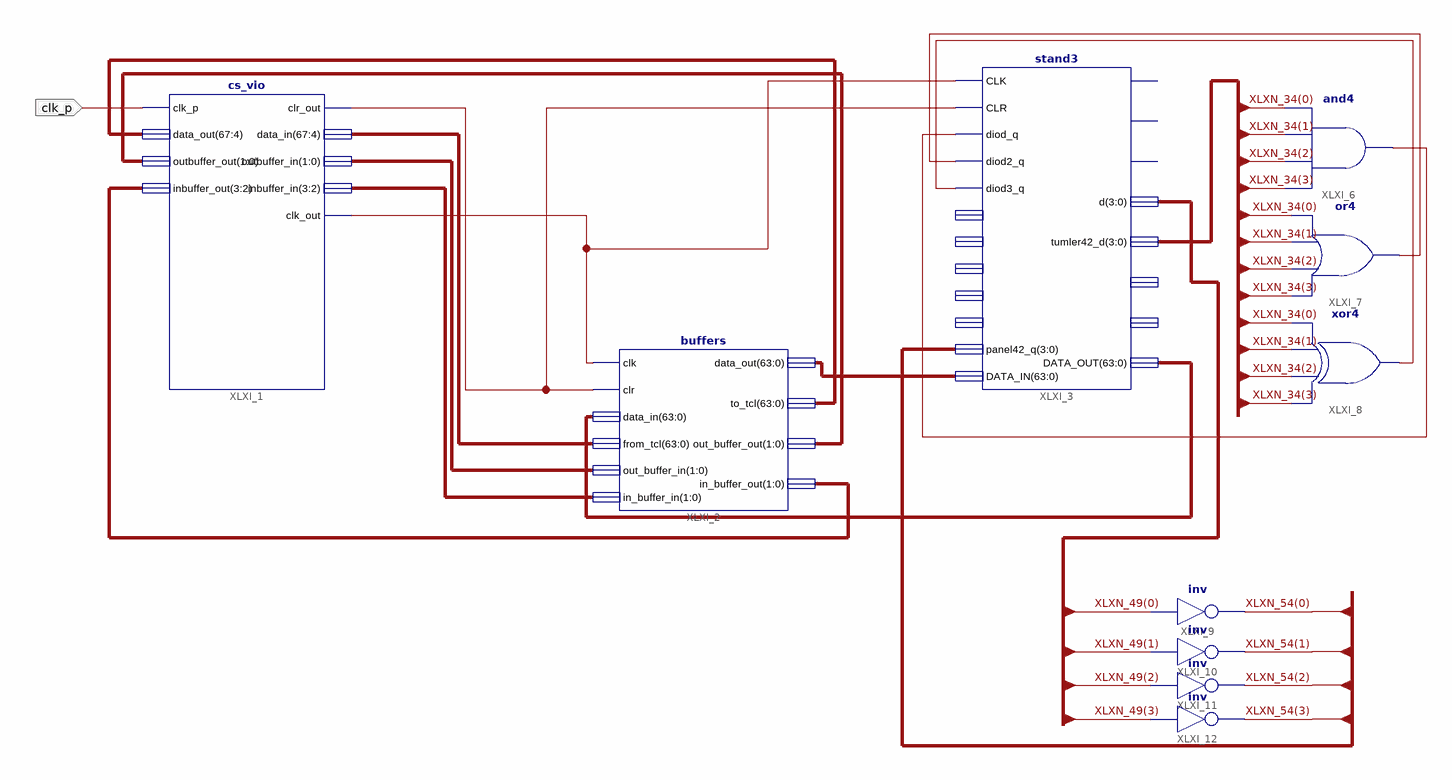
[diagram p0: schematic sheet 1]
// Xilinx ISE schematic top7.sch (spartan6) as structural Verilog: 10 symbols, 1 ports
module top7 (
  input  clk_p
);

  wire XLXN_4, XLXN_25, XLXN_30, XLXN_32, XLXN_33;
  wire [1:0] XLXN_2, XLXN_13;
  wire [3:0] XLXN_34, XLXN_49, XLXN_54;
  wire [3:2] XLXN_3, XLXN_10;
  wire [63:0] XLXN_26, XLXN_27;
  wire [67:4] XLXN_1, XLXN_14;

  stand3 XLXI_3 (
    .CLK(XLXN_4), .CLR(XLXN_25), .diod_q(XLXN_30), .diod2_q(XLXN_32), .diod3_q(XLXN_33), .panel42_q(XLXN_54),
    .DATA_IN(XLXN_26), .d(XLXN_49), .tumler42_d(XLXN_34), .DATA_OUT(XLXN_27));  // open: q, digit2_q, digit3_q, digit4_q, panel4_q, CLR_O, redButton_d, redButton2_d, tumler43_d, tumler44_d
  buffers XLXI_2 (
    .clk(XLXN_4), .clr(XLXN_25), .data_in(XLXN_27), .from_tcl(XLXN_1), .out_buffer_in(XLXN_2),
    .in_buffer_in(XLXN_3), .data_out(XLXN_26), .to_tcl(XLXN_14), .out_buffer_out(XLXN_13),
    .in_buffer_out(XLXN_10));
  cs_vio XLXI_1 (
    .clk_p(clk_p), .data_out(XLXN_14), .outbuffer_out(XLXN_13), .inbuffer_out(XLXN_10), .clr_out(XLXN_25),
    .clk_out(XLXN_4), .data_in(XLXN_1), .outbuffer_in(XLXN_2), .inbuffer_in(XLXN_3));
  and XLXI_6 (XLXN_30, XLXN_34[3], XLXN_34[2], XLXN_34[1], XLXN_34[0]);
  or XLXI_7 (XLXN_32, XLXN_34[3], XLXN_34[2], XLXN_34[1], XLXN_34[0]);
  xor XLXI_8 (XLXN_33, XLXN_34[3], XLXN_34[2], XLXN_34[1], XLXN_34[0]);
  not XLXI_9 (XLXN_54[0], XLXN_49[0]);
  not XLXI_10 (XLXN_54[1], XLXN_49[1]);
  not XLXI_11 (XLXN_54[2], XLXN_49[2]);
  not XLXI_12 (XLXN_54[3], XLXN_49[3]);
endmodule
